# Altium schematic sheet Copy of ADC and Ammeter.SchDoc
size A3; SheetNumber: 6; SheetTotal: 7
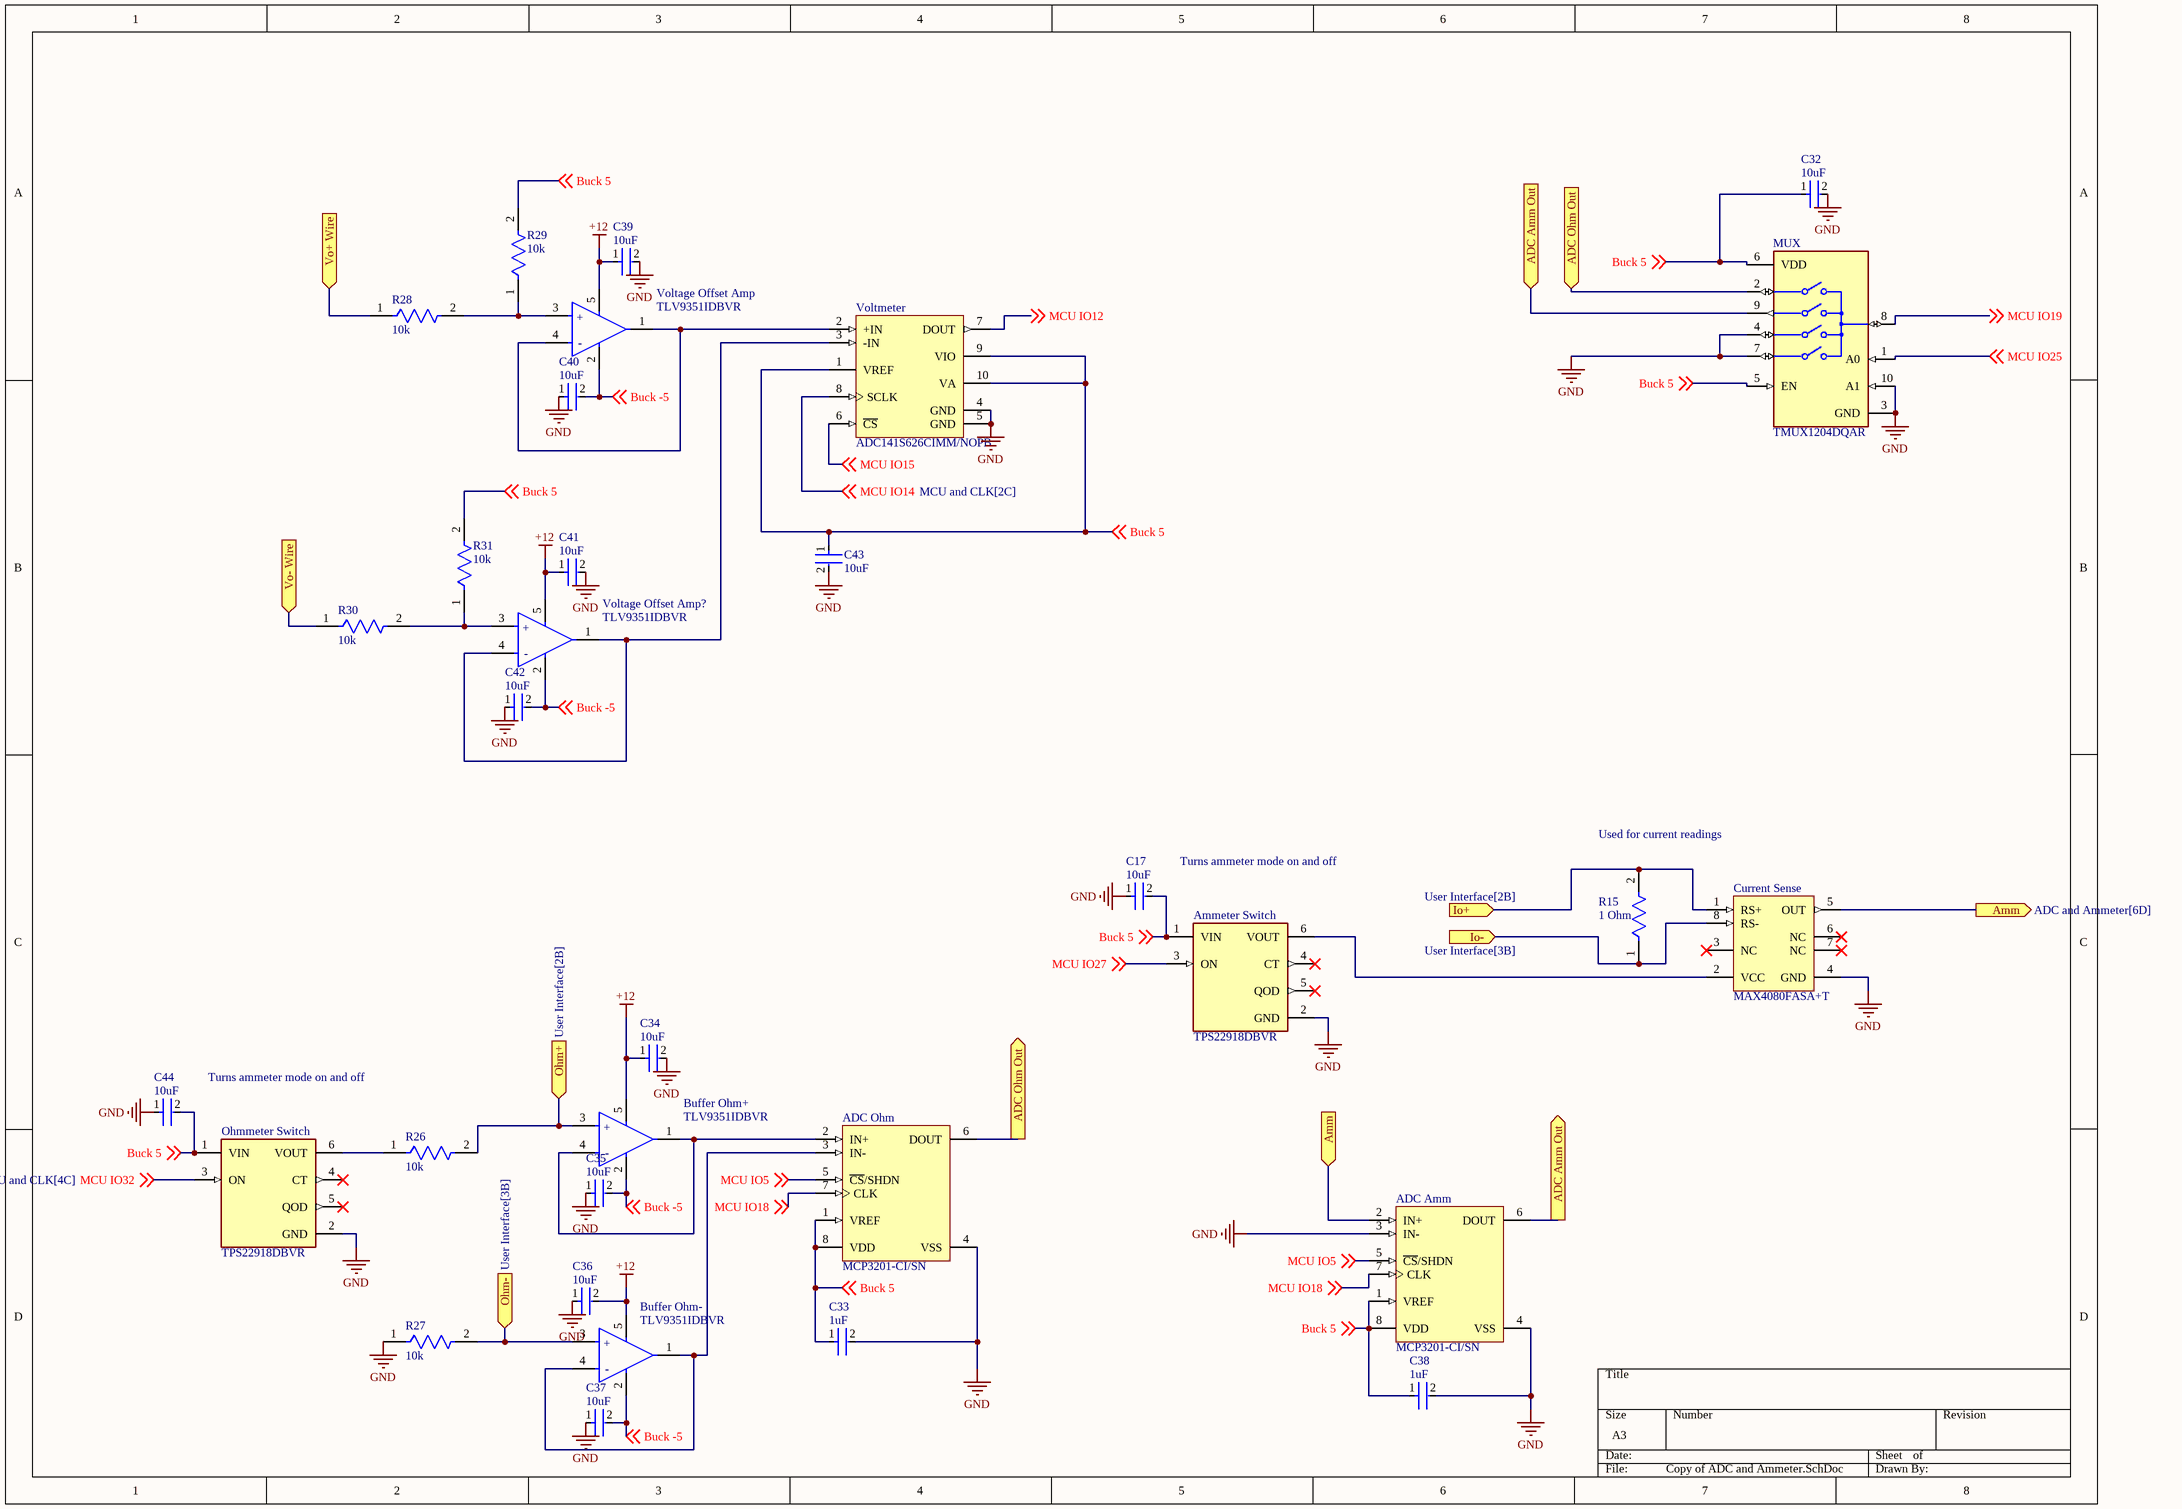
[diagram p0: Copy of ADC and Ammeter.SchDoc]

## Parts
ADC_Amm  MCP3201-CI/SN  [SOIC-SN8_L]
ADC_Ohm  MCP3201-CI/SN  [SOIC-SN8_L]
Ammeter_Switch  TPS22918DBVR  [FP-DBV0006A-MFG]
Buffer_Ohm+  TLV9351IDBVR  [FP-DBV0005A-IPC_C]
Buffer_Ohm-  TLV9351IDBVR  [FP-DBV0005A-IPC_C]
C17  10uF  [FP-CL21-IPC_B]
C32  10uF  [FP-CL21-IPC_B]
C33  1uF  [FP-CL10-IPC_B]
C34  10uF  [FP-CL21-IPC_B]
C35  10uF  [FP-CL21-IPC_B]
C36  10uF  [FP-CL21-IPC_B]
C37  10uF  [FP-CL21-IPC_B]
C38  1uF  [FP-CL10-IPC_B]
C39  10uF  [FP-CL21-IPC_B]
C40  10uF  [FP-CL21-IPC_B]
C41  10uF  [FP-CL21-IPC_B]
C42  10uF  [FP-CL21-IPC_B]
C43  10uF  [FP-CL21-IPC_B]
C44  10uF  [FP-CL21-IPC_B]
Current_Sense  MAX4080FASA+T  [MAXM-S8+2_M]
MUX  TMUX1204DQAR  [FP-DQA0010A-MFG]
Ohmmeter_Switch  TPS22918DBVR  [FP-DBV0006A-MFG]
R15  1 Ohm  [FP-RMCF1210-IPC_C]
R26  10k  [FP-RK73H1J-IPC_B]
R27  10k  [FP-RK73H1J-IPC_B]
R28  10k  [FP-RK73H1J-IPC_B]
R29  10k  [FP-RK73H1J-IPC_B]
R30  10k  [FP-RK73H1J-IPC_B]
R31  10k  [FP-RK73H1J-IPC_B]
Voltage_Offset_Amp  TLV9351IDBVR  [FP-DBV0005A-IPC_C]
Voltage_Offset_Amp?  TLV9351IDBVR  [FP-DBV0005A-IPC_C]
Voltmeter  ADC141S626CIMM/NOPB  [MUB10A_M]

## Ports
ADC Amm Out (in, see ADC and Ammeter[6D]), ADC Amm Out (out, see ADC and Ammeter[6A]), ADC Ohm Out (in, see ADC and Ammeter[4D]), ADC Ohm Out (out, see ADC and Ammeter[6A]), Amm (in, see ADC and Ammeter[8C]), Amm (out, see ADC and Ammeter[6D]), Io+ (in, see User Interface[2B]), Io- (in, see User Interface[3B]), Ohm+ (in, see User Interface[2B]), Ohm- (in, see User Interface[3B]), Vo+ Wire (in, see User Interface[1C]), Vo- Wire (in, see User Interface[4B])

## Nets
+12: Buffer_Ohm+.5(V+) Buffer_Ohm-.5(V+) C34.1 C36.2 C39.1 C41.1 Voltage_Offset_Amp.5(V+) Voltage_Offset_Amp?.5(V+)
GND: ADC_Amm.3(IN-) ADC_Amm.4(VSS) ADC_Ohm.4(VSS) Ammeter_Switch.2(GND) C17.1 C32.2 C33.2 C34.2 C35.1 C36.1 C37.1 C38.2 C39.2 C40.1 C41.2 C42.1 C43.2 C44.1 Current_Sense.4(GND) MUX.3(GND) MUX.4(S3) MUX.7(S4) MUX.10(A1) Ohmmeter_Switch.2(GND) R27.1 Voltmeter.4(GND) Voltmeter.5(GND)
ADC Amm Out: ADC_Amm.6(DOUT) MUX.9(S2) ; port ADC Amm Out
ADC Ohm Out: ADC_Ohm.6(DOUT) MUX.2(S1) ; port ADC Ohm Out
Amm: ADC_Amm.2(IN+) Current_Sense.5(OUT) ; port Amm
Buck 5: ADC_Amm.1(VREF) ADC_Amm.8(VDD) ADC_Ohm.1(VREF) ADC_Ohm.8(VDD) Ammeter_Switch.1(VIN) C17.2 C32.1 C33.1 C38.1 C43.1 C44.2 MUX.5(EN) MUX.6(VDD) Ohmmeter_Switch.1(VIN) R29.2 R31.2 Voltmeter.1(VREF) Voltmeter.9(VIO) Voltmeter.10(VA) ; off-sheet Buck 5
Buck -5: Buffer_Ohm+.2(V-) Buffer_Ohm-.2(V-) C35.2 C37.2 C40.2 C42.2 Voltage_Offset_Amp.2(V-) Voltage_Offset_Amp?.2(V-) ; off-sheet Buck -5
Io+: Current_Sense.1(RS+) R15.2 ; port Io+
Io-: Current_Sense.8(RS-) R15.1 ; port Io-
MCU IO5: ADC_Amm.5(~{CS}/SHDN) ADC_Ohm.5(~{CS}/SHDN) ; off-sheet MCU IO5
MCU IO12: Voltmeter.7(DOUT) ; off-sheet MCU IO12
MCU IO14: Voltmeter.8(SCLK) ; off-sheet MCU IO14
MCU IO15: Voltmeter.6(~{CS}) ; off-sheet MCU IO15
MCU IO18: ADC_Amm.7(CLK) ADC_Ohm.7(CLK) ; off-sheet MCU IO18
MCU IO19: MUX.8(D) ; off-sheet MCU IO19
MCU IO25: MUX.1(A0) ; off-sheet MCU IO25
MCU IO27: Ammeter_Switch.3(ON) ; off-sheet MCU IO27
MCU IO32: Ohmmeter_Switch.3(ON) ; off-sheet MCU IO32
Ohm+: Buffer_Ohm+.3(IN+) R26.2 ; port Ohm+
Ohm-: Buffer_Ohm-.3(IN+) R27.2 ; port Ohm-
Vo+ Wire: R28.1 ; port Vo+ Wire
Vo- Wire: R30.1 ; port Vo- Wire
NetADC_Ohm_2: ADC_Ohm.2(IN+) Buffer_Ohm+.1(OUT) Buffer_Ohm+.4(IN-)
NetADC_Ohm_3: ADC_Ohm.3(IN-) Buffer_Ohm-.1(OUT) Buffer_Ohm-.4(IN-)
NetAmmeter_Switch_6: Ammeter_Switch.6(VOUT) Current_Sense.2(VCC)
NetOhmmeter_Switch_6: Ohmmeter_Switch.6(VOUT) R26.1
NetR28_2: R28.2 R29.1 Voltage_Offset_Amp.3(IN+)
NetR30_2: R30.2 R31.1 Voltage_Offset_Amp?.3(IN+)
NetVoltage_Offset_Amp?_1: Voltage_Offset_Amp?.1(OUT) Voltage_Offset_Amp?.4(IN-) Voltmeter.3(-IN)
NetVoltage_Offset_Amp_1: Voltage_Offset_Amp.1(OUT) Voltage_Offset_Amp.4(IN-) Voltmeter.2(+IN)

Not connected (* = marked no-connect by the designer): Ammeter_Switch 4(CT)* 5(QOD)*; Current_Sense 3(NC)* 6(NC)* 7(NC)*; Ohmmeter_Switch 4(CT)* 5(QOD)*

## Notes on the sheet
- Used for current readings
- Turns ammeter mode on and off
- (in symbol CMP-04895-000384-1) +; -

## Library data of the parts
ADC_Amm ADC_Ohm = CMP-0188-00469-2: 2.7V 12-Bit A/D Converter with SPI Serial Interface, 8-Pin SOIC 150mil, C Performance Grade, Industrial Temperature; ComponentLink1URL: http://www.microchip.com/; DatasheetVersion: revF, Aug-2011; RevisionNote: URLs added. DatasheetVersion updated.; Code_IPC: SOIC127P600-8; ComponentLink3URL: http://www.microchip.com/stellent/groups/techpub_sg/documents/packagingspec/en012702.pdf; ComponentLink3Description: Package Specification; ComponentLink2URL: http://ww1.microchip.com/downloads/en/DeviceDoc/21290F.pdf; PackageReference: SOIC-SN8; ComponentLink1Description: Manufacturer URL; ComponentLink2Description: Datasheet; PackageVersion: revBB, Aug-2009; Code_JEDEC: MS-012; PackageDescription: 8-Lead Plastic Small Outline (SN) - Narrow, 3.90mm Body [SOIC]
Ammeter_Switch Ohmmeter_Switch = CMP-04910-000024-1: IC SINGLE CHANNEL LOAD SWITCH; Manufacturer: Texas Instruments; Output Current: 2A; Max Junction Temp: +125°C; Min Supply Voltage: 1V; Nominal Supply Current: 8.3-10.2uA; Max Supply Voltage: 5.5V; Number Of Outputs: 1; Standoff Height: 0mm; RoHS: TRUE; ComponentLink2URL: http://www.ti.com/lit/ds/symlink/tps22918.pdf; Lead Free: Yes; Device Class L1: Integrated Circuits (ICs); Automotive: No; Temperature Range Low: -40°C; Ambient Temperature Range High: +105°C; Category: IC; Temperature Range High: +105°C; Ambient Temperature Range Low: -40°C; Mouser Description: 5.5V, 2A, 52m? Load Switch with Adjustable Rise Time and Adjustable Quick Output Discharge 6-SOT-23 -40 to 105; ComponentLink2Description: Datasheet; Manufacturer Part Number: TPS22918DBVR; Octopart: https://octopart.com/tps22918dbvr-texas+instruments-71360943; Height: 1.45mm; Package: DBV0006A; Device Class L3: unset; Digikey Description: IC SINGLE CHANNEL LOAD SWITCH; Temperature: -40°C to +105°C; Device Class L2: Power Management ICs; Ipc Land Pattern Name: SOT95P280X145-6
Buffer_Ohm+ Buffer_Ohm- Voltage_Offset_Amp Voltage_Offset_Amp? = CMP-04895-000384-1: OPAMP
C17 C32 C34-C37 C39-C44 = CMP-13271-004605-1: CL21 Series 0805 10uF 25V ±10% Tolerance X5R Multilayer Ceramic Chip Capacitor; Capacitance: 10uF; Dielectric: X5R; RoHS Compliant: Yes; Voltage Rating (DC): 25V; Case/Package: 0805; Tolerance: 10%
C33 C38 = CMP-13271-001078-1: Cap Ceramic 1uF 25V X5R ±10% Pad SMD 0603 +85°C T/R; Tolerance: 10%; Voltage Rating (DC): 25V; Case/Package: 0603; Capacitance: 1uF; Dielectric: X5R
Current_Sense = CMP-0252-00140-1: 76 V, High-Side, Uni-directional Current-Sense Amplifier, 5 V / V Gain, -40 to 125 degC, 8-Pin SOIC (S8+2), Pb-Free, Tape and Reel; Industry Qualified: Automotive - AECQ100, Automotive - General; Gain: 5 V/V, 20 V/V ,60 V/V; Bi-Dir. Curr. Sense: No; ComponentLink3URL: http://pdfserv.maximintegrated.com/package_dwgs/21-0041.PDF; ComponentLink2URL: http://datasheets.maximintegrated.com/en/ds/MAX4080-MAX4081.pdf; DatasheetVersion: Rev. 4; PackageDescription: 8-Pin Small-Outline IC, Narrow (0.15in) (S8+2), Body 4.90 x 3.90 mm, Pitch 1.27 mm; ComponentLink1Description: Manufacturer URL; PackageVersion: Rev. D, 10/2012; PartNumber: MAX4080FASA+T; Mounting Technology: Surface Mount; ComponentLink2Description: Datasheet; ComponentLink1URL: http://www.maximintegrated.com/; ComponentLink3Description: Package Specification; PackageReference: S8+2; Code_JEDEC: MS012
MUX = CMP-04892-000027-1: IC SWITCH
R15 = CMP-26527-006107-1: 1Ω ±1% 0.5W 1210 Thick Film Chip Resistor AEC-Q200 compliant; Temperature Coefficient: 400ppm/°C; Max Power Dissipation: 500mW; Resistance: 1R; Case/Package: 1210; Max Operating Temperature: 155°C; Military Standard: Not; Height: 0.028inch; Case Code (Imperial): 1210; Radiation Hardening: No; Tolerance: 1%; Packaging: Tape and Reel; Features: Automotive AEC-Q200; Width: 0.098inch; Case Code (Metric): 3225; Mount: Surface Mount; Construction: Rectangular; Number of Terminations: 2; RoHS Compliant: Yes; Resistor Type: Thick Film; Depth: 2.5mm; Min Operating Temperature: -55°C; Length: 0.126inch; Series: RMCF; Contact Plating: Tin
R26-R31 = CMP-2000-01751-2: 10kΩ ±1% 0.1W Chip Resistor 0603 Thick Film AEC-Q200 Qualified; Power Rating: 100mW; Temperature Coefficient: 100ppm/°C; Resistance: 10kR; Voltage Rating: 50V; Construction: Rectangular; Max Operating Temperature: 155°C; Resistor Type: Thick Film; Case/Package: 0603; Military Standard: MIL-R-55342F; Depth: 0.8mm; Termination: SMD/SMT; Min Operating Temperature: -55°C; RoHS Compliant: Yes; Width: 0.8mm; Length: 1.6mm; Height: 0.45mm; Case Code (Metric): 1608; Package Quantity: 10000; Lead Free: Lead Free; Series: RK73H; Packaging: Tape and Reel; Case Code (Imperial): 0603; Tolerance: 1%
Voltmeter = CMP-0054-00477-2: 14-Bit, 50 kSPS to 250 kSPS, Differential Input, Micro Power A/D Converter, 10-pin Mini SOIC, Pb-Free; Manufacturer: National Semiconductor; CompType: ADC IC; PowerWise: Y; PackageTopMarking: ZXTT*X94C; DatasheetVersion: Jan-2009; PackageVersion: revB, Jul-2003; RoHS: Y; ComponentLink3Description: MUB10A Package Page; ComponentLink2URL: http://www.national.com/pf/AD/ADC141S626.html; Code_JEDEC: MO-187-BA; PackageReference: MUB10A; ComponentLink3URL: http://www.national.com/packaging/folders/mub10a.html; ComponentLink1URL: http://www.national.com/ds/AD/ADC141S626.pdf; PinCount: 10; RevisionNote: Component URLs added; PackageDescription: Mini-SO, Molded, .118 x .118 x .034in Body, 10 Lead, .0197in Pitch; ComponentLink1Description: ADC141S626 Datasheet; ComponentLink2Description: ADC141S626 Web Page